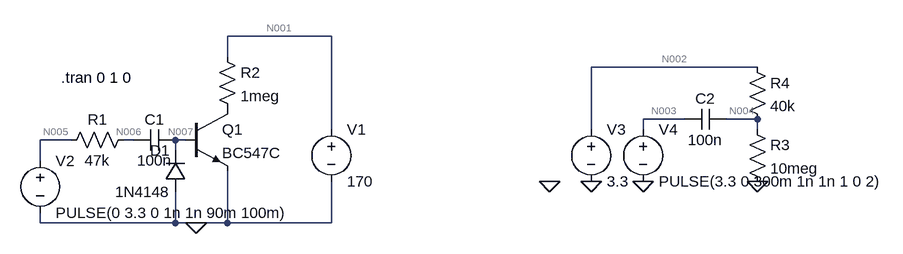
[diagram p0: schematic high side driver.asc]
high side driver.asc, the LTspice schematic file:
Version 4
SHEET 1 1328 680
WIRE 432 0 272 0
WIRE 272 32 272 0
WIRE 1088 48 832 48
WIRE 976 128 912 128
WIRE 1088 128 1040 128
WIRE 432 144 432 0
WIRE 832 144 832 48
WIRE 912 144 912 128
WIRE 1088 144 1088 128
WIRE 32 160 -16 160
WIRE 128 160 112 160
WIRE 208 160 192 160
WIRE 192 176 192 160
WIRE -16 192 -16 160
WIRE -16 288 -16 272
WIRE 192 288 192 240
WIRE 192 288 -16 288
WIRE 224 288 192 288
WIRE 272 288 272 208
WIRE 272 288 224 288
WIRE 432 288 432 224
WIRE 432 288 272 288
FLAG 224 288 0
FLAG 912 224 0
FLAG 1088 224 0
FLAG 768 224 0
FLAG 832 224 0
SYMBOL npn 208 112 R0
SYMATTR InstName Q1
SYMATTR Value BC547C
SYMBOL res 128 144 R90
WINDOW 0 0 56 VBottom 2
WINDOW 3 32 56 VTop 2
SYMATTR InstName R1
SYMATTR Value 47k
SYMATTR SpiceLine ""
SYMBOL diode 208 240 R180
WINDOW 0 24 64 Left 2
WINDOW 3 24 0 Left 2
SYMATTR InstName D1
SYMATTR Value 1N4148
SYMBOL voltage 432 128 R0
WINDOW 123 0 0 Left 2
WINDOW 39 0 0 Left 2
SYMATTR InstName V1
SYMATTR Value 170
SYMATTR Value2 ""
SYMATTR SpiceLine ""
SYMBOL voltage -16 176 R0
WINDOW 123 0 0 Left 2
WINDOW 39 0 0 Left 2
SYMATTR InstName V2
SYMATTR Value PULSE(0 3.3 0 1n 1n 90m 100m)
SYMATTR Value2 ""
SYMATTR SpiceLine ""
SYMBOL res 256 16 R0
SYMATTR InstName R2
SYMATTR Value 1meg
SYMATTR SpiceLine ""
SYMBOL cap 192 144 R90
WINDOW 0 0 32 VBottom 2
WINDOW 3 32 32 VTop 2
SYMATTR InstName C1
SYMATTR Value 100n
SYMATTR SpiceLine ""
SYMBOL voltage 912 128 R0
WINDOW 123 0 0 Left 2
WINDOW 39 0 0 Left 2
SYMATTR InstName V4
SYMATTR Value PULSE(3.3 0 300m 1n 1n 1 0 2)
SYMATTR Value2 ""
SYMATTR SpiceLine ""
SYMBOL cap 1040 112 R90
WINDOW 0 0 32 VBottom 2
WINDOW 3 32 32 VTop 2
SYMATTR InstName C2
SYMATTR Value 100n
SYMATTR SpiceLine ""
SYMBOL res 1072 128 R0
SYMATTR InstName R3
SYMATTR Value 10meg
SYMATTR SpiceLine ""
SYMBOL res 1072 32 R0
SYMATTR InstName R4
SYMATTR Value 40k
SYMATTR SpiceLine ""
SYMBOL voltage 832 128 R0
WINDOW 123 0 0 Left 2
WINDOW 39 0 0 Left 2
SYMATTR InstName V3
SYMATTR Value 3.3
SYMATTR Value2 ""
SYMATTR SpiceLine ""
TEXT 16 64 Left 2 !.tran 0 1 0

The netlist it stands for:
* high side driver.asc
Q1 P001 N007 0 0 BC547C
R1 N006 N005 47k
D1 0 N007 1N4148
V1 N001 0 170
V2 N005 0 PULSE(0 3.3 0 1n 1n 90m 100m)
R2 N001 P001 1meg
C1 N007 N006 100n
V4 N003 0 PULSE(3.3 0 300m 1n 1n 1 0 2)
C2 N004 N003 100n
R3 N004 0 10meg
R4 N002 N004 40k
V3 N002 0 3.3
.model D D
.lib standard.dio
.model NPN NPN
.model PNP PNP
.lib standard.bjt
.tran 0 1 0
.backanno
.end

* Results of the author's LTspice run, read from the files saved beside the schematic
* Operating Point, zero values left out:
*   V(p001) = 170 V
*   V(n007) = 3.165 mV
*   V(n001) = 170 V
*   V(n003) = 3.3 V
*   V(n004) = 3.287 V
*   V(n002) = 3.3 V
*   Ic(Q1) = 170.2 pA
*   Ib(Q1) = -170 pA
*   I(D1) = -170 pA
*   I(R4) = 328.7 nA
*   I(R3) = 328.7 nA
*   I(R2) = 170.2 pA
*   I(V3) = -328.7 nA
*   I(V1) = -170.2 pA
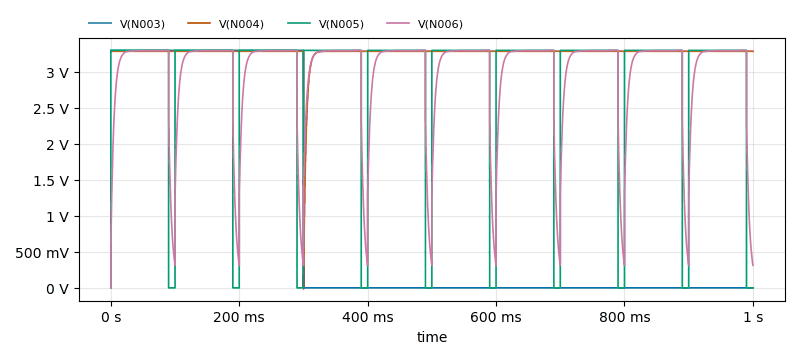
[diagram p1: Transient Analysis of high side driver.asc, plotted from the saved traces]
* Transient Analysis, 1 run:
*   V(N003): min 0 V, max 3.3 V, average 990 mV, rms 1.807 V, last 0 V
*   V(N004): min -13.15 mV, max 3.287 V, average 3.274 V, rms 3.277 V, last 3.287 V
*   V(N005): min 0 V, max 3.3 V, average 2.97 V, rms 3.131 V, last 0 V
*   V(N006): min 0 V, max 3.298 V, average 2.967 V, rms 3.059 V, last 313 mV